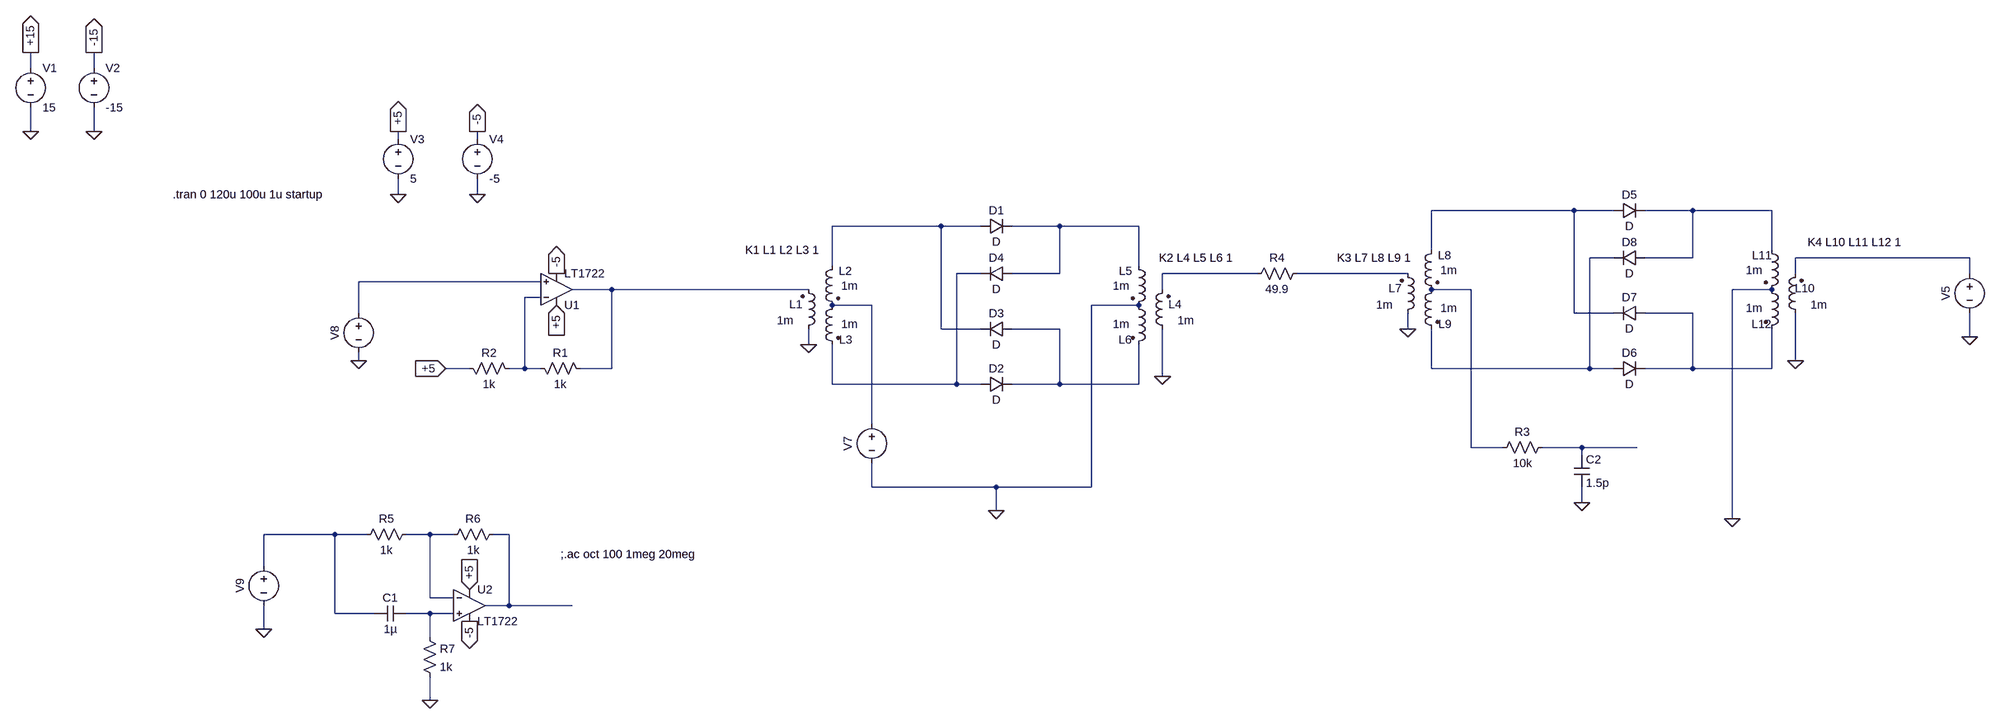
[diagram p0: schematic QPSK_Gilbert_Cell_Mixer.asc]
QPSK_Gilbert_Cell_Mixer.asc, the LTspice schematic file:
Version 4
SHEET 1 3956 1012
WIRE -624 -288 -624 -320
WIRE -496 -288 -496 -320
WIRE -624 -160 -624 -208
WIRE -496 -160 -496 -208
WIRE 416 -144 416 -160
WIRE 576 -144 576 -160
WIRE 416 -32 416 -64
WIRE 576 -32 576 -64
WIRE 2880 0 2592 0
WIRE 2960 0 2880 0
WIRE 3120 0 3024 0
WIRE 3280 0 3120 0
WIRE 1600 32 1312 32
WIRE 1680 32 1600 32
WIRE 1840 32 1744 32
WIRE 2000 32 1840 32
WIRE 2592 80 2592 0
WIRE 3280 80 3280 0
WIRE 2960 96 2912 96
WIRE 3120 96 3120 0
WIRE 3120 96 3024 96
WIRE 3680 96 3328 96
WIRE 1312 112 1312 32
WIRE 2000 112 2000 32
WIRE 1680 128 1632 128
WIRE 1840 128 1840 32
WIRE 1840 128 1744 128
WIRE 2240 128 2048 128
WIRE 2544 128 2320 128
WIRE 3328 128 3328 96
WIRE 3680 128 3680 96
WIRE 704 144 336 144
WIRE 848 160 768 160
WIRE 1264 160 848 160
WIRE 2048 160 2048 128
WIRE 2672 160 2592 160
WIRE 3280 160 3200 160
WIRE 704 176 672 176
WIRE 1392 192 1312 192
WIRE 2000 192 1904 192
WIRE 336 208 336 144
WIRE 2880 208 2880 0
WIRE 2960 208 2880 208
WIRE 3120 208 3024 208
WIRE 1600 240 1600 32
WIRE 1680 240 1600 240
WIRE 1840 240 1744 240
WIRE 2544 240 2544 208
WIRE 3680 256 3680 208
WIRE 1264 272 1264 240
WIRE 336 304 336 288
WIRE 3328 304 3328 208
WIRE 560 320 512 320
WIRE 672 320 672 176
WIRE 672 320 640 320
WIRE 704 320 672 320
WIRE 848 320 848 160
WIRE 848 320 784 320
WIRE 2592 320 2592 240
WIRE 2912 320 2912 96
WIRE 2912 320 2592 320
WIRE 2960 320 2912 320
WIRE 3120 320 3120 208
WIRE 3120 320 3024 320
WIRE 3280 320 3280 240
WIRE 3280 320 3120 320
WIRE 2048 336 2048 240
WIRE 1312 352 1312 272
WIRE 1632 352 1632 128
WIRE 1632 352 1312 352
WIRE 1680 352 1632 352
WIRE 1840 352 1840 240
WIRE 1840 352 1744 352
WIRE 2000 352 2000 272
WIRE 2000 352 1840 352
WIRE 1392 432 1392 192
WIRE 2672 480 2672 160
WIRE 2736 480 2672 480
WIRE 2896 480 2816 480
WIRE 3008 480 2896 480
WIRE 2896 496 2896 480
WIRE 1392 560 1392 512
WIRE 1712 560 1392 560
WIRE 1904 560 1904 192
WIRE 1904 560 1712 560
WIRE 2896 592 2896 560
WIRE 1712 608 1712 560
WIRE 3200 624 3200 160
WIRE 288 656 144 656
WIRE 352 656 288 656
WIRE 480 656 432 656
WIRE 528 656 480 656
WIRE 640 656 608 656
WIRE 144 720 144 656
WIRE 480 784 480 656
WIRE 528 784 480 784
WIRE 640 800 640 656
WIRE 640 800 592 800
WIRE 768 800 640 800
WIRE 288 816 288 656
WIRE 368 816 288 816
WIRE 480 816 432 816
WIRE 528 816 480 816
WIRE 144 848 144 800
WIRE 480 864 480 816
WIRE 480 992 480 944
FLAG -624 -320 +15
IOPIN -624 -320 Out
FLAG -496 -320 -15
IOPIN -496 -320 Out
FLAG -624 -160 0
FLAG -496 -160 0
FLAG 2048 336 0
FLAG 1712 608 0
FLAG 336 304 0
FLAG 416 -160 +5
IOPIN 416 -160 Out
FLAG 416 -32 0
FLAG 576 -32 0
FLAG 576 -160 -5
IOPIN 576 -160 Out
FLAG 1264 272 0
FLAG 512 320 +5
IOPIN 512 320 In
FLAG 736 128 -5
IOPIN 736 128 Out
FLAG 736 192 +5
IOPIN 736 192 In
FLAG 3328 304 0
FLAG 2544 240 0
FLAG 3680 256 0
FLAG 3200 624 0
FLAG 560 832 -5
IOPIN 560 832 Out
FLAG 560 768 +5
IOPIN 560 768 In
FLAG 480 992 0
FLAG 144 848 0
FLAG 2896 592 0
SYMBOL voltage -624 -304 R0
WINDOW 123 0 0 Left 0
WINDOW 39 0 0 Left 0
SYMATTR InstName V1
SYMATTR Value 15
SYMBOL voltage -496 -304 R0
WINDOW 123 0 0 Left 0
WINDOW 39 0 0 Left 0
SYMATTR InstName V2
SYMATTR Value -15
SYMBOL ind2 1248 256 M180
WINDOW 0 -23 66 Left 2
WINDOW 3 -48 33 Left 2
SYMATTR InstName L1
SYMATTR Value 1m
SYMATTR Type ind
SYMBOL ind2 1328 96 M0
WINDOW 0 -24 27 Left 2
WINDOW 3 -36 57 Left 2
SYMATTR InstName L2
SYMATTR Value 1m
SYMATTR Type ind
SYMBOL ind2 1328 176 M0
WINDOW 0 -25 86 Left 2
WINDOW 3 -36 54 Left 2
SYMATTR InstName L3
SYMATTR Value 1m
SYMATTR Type ind
SYMBOL diode 1680 48 R270
WINDOW 0 32 32 VTop 2
WINDOW 3 0 32 VBottom 2
SYMATTR InstName D1
SYMBOL diode 1680 368 R270
WINDOW 0 32 32 VTop 2
WINDOW 3 0 32 VBottom 2
SYMATTR InstName D2
SYMBOL ind2 2064 256 R180
WINDOW 0 -23 66 Left 2
WINDOW 3 -48 33 Left 2
SYMATTR InstName L4
SYMATTR Value 1m
SYMATTR Type ind
SYMBOL ind2 1984 96 R0
WINDOW 0 -24 27 Left 2
WINDOW 3 -36 57 Left 2
SYMATTR InstName L5
SYMATTR Value 1m
SYMATTR Type ind
SYMBOL ind2 1984 176 R0
WINDOW 0 -25 86 Left 2
WINDOW 3 -36 54 Left 2
SYMATTR InstName L6
SYMATTR Value 1m
SYMATTR Type ind
SYMBOL diode 1744 224 R90
WINDOW 0 0 32 VBottom 2
WINDOW 3 32 32 VTop 2
SYMATTR InstName D3
SYMBOL diode 1744 112 R90
WINDOW 0 0 32 VBottom 2
WINDOW 3 32 32 VTop 2
SYMATTR InstName D4
SYMBOL voltage 1392 416 R0
WINDOW 0 -32 56 VBottom 2
WINDOW 3 32 56 Invisible 2
WINDOW 123 0 0 Left 0
SYMATTR InstName V7
SYMATTR Value SINE(0 500m 10Meg 0 0 0)
SYMATTR SpiceLine Rser=0.0001
SYMBOL voltage 336 192 R0
WINDOW 0 -32 56 VBottom 2
WINDOW 3 32 56 Invisible 2
WINDOW 123 0 0 Left 0
SYMATTR InstName V8
SYMATTR Value PULSE(0 5 0 0.1u 0.1u 1u 2u)
SYMATTR SpiceLine Rser=0.0001
SYMBOL voltage 416 -160 R0
WINDOW 123 0 0 Left 0
WINDOW 39 0 0 Left 0
SYMATTR InstName V3
SYMATTR Value 5
SYMBOL voltage 576 -160 R0
WINDOW 123 0 0 Left 0
WINDOW 39 0 0 Left 0
SYMATTR InstName V4
SYMATTR Value -5
SYMBOL res 688 304 M90
WINDOW 0 0 56 VBottom 2
WINDOW 3 32 56 VTop 2
SYMATTR InstName R1
SYMATTR Value 1k
SYMBOL res 544 304 M90
WINDOW 0 0 56 VBottom 2
WINDOW 3 32 56 VTop 2
SYMATTR InstName R2
SYMATTR Value 1k
SYMBOL Opamps\\LT1722 736 224 M180
SYMATTR InstName U1
SYMBOL ind2 2528 224 M180
WINDOW 0 -23 66 Left 2
WINDOW 3 -48 33 Left 2
SYMATTR InstName L7
SYMATTR Value 1m
SYMATTR Type ind
SYMBOL ind2 2608 64 M0
WINDOW 0 -24 27 Left 2
WINDOW 3 -36 57 Left 2
SYMATTR InstName L8
SYMATTR Value 1m
SYMATTR Type ind
SYMBOL ind2 2608 144 M0
WINDOW 0 -25 86 Left 2
WINDOW 3 -36 54 Left 2
SYMATTR InstName L9
SYMATTR Value 1m
SYMATTR Type ind
SYMBOL diode 2960 16 R270
WINDOW 0 32 32 VTop 2
WINDOW 3 0 32 VBottom 2
SYMATTR InstName D5
SYMBOL diode 2960 336 R270
WINDOW 0 32 32 VTop 2
WINDOW 3 0 32 VBottom 2
SYMATTR InstName D6
SYMBOL ind2 3344 224 R180
WINDOW 0 -23 66 Left 2
WINDOW 3 -48 33 Left 2
SYMATTR InstName L10
SYMATTR Value 1m
SYMATTR Type ind
SYMBOL ind2 3264 64 R0
WINDOW 0 -24 27 Left 2
WINDOW 3 -36 57 Left 2
SYMATTR InstName L11
SYMATTR Value 1m
SYMATTR Type ind
SYMBOL ind2 3264 144 R0
WINDOW 0 -25 86 Left 2
WINDOW 3 -36 54 Left 2
SYMATTR InstName L12
SYMATTR Value 1m
SYMATTR Type ind
SYMBOL diode 3024 192 R90
WINDOW 0 0 32 VBottom 2
WINDOW 3 32 32 VTop 2
SYMATTR InstName D7
SYMBOL diode 3024 80 R90
WINDOW 0 0 32 VBottom 2
WINDOW 3 32 32 VTop 2
SYMATTR InstName D8
SYMBOL voltage 3680 112 R0
WINDOW 0 -32 56 VBottom 2
WINDOW 3 32 56 Invisible 2
WINDOW 123 0 0 Left 0
SYMATTR InstName V5
SYMATTR Value SINE(0 500m 10Meg 0 0 0)
SYMATTR SpiceLine Rser=0.0001
SYMBOL res 2336 112 R90
WINDOW 0 0 56 VBottom 2
WINDOW 3 32 56 VTop 2
SYMATTR InstName R4
SYMATTR Value 49.9
SYMATTR SpiceLine tol=1 pwr=0.1
SYMBOL res 448 640 R90
WINDOW 0 0 56 VBottom 2
WINDOW 3 32 56 VTop 2
SYMATTR InstName R5
SYMATTR Value 1k
SYMBOL res 624 640 R90
WINDOW 0 0 57 VBottom 2
WINDOW 3 32 56 VTop 2
SYMATTR InstName R6
SYMATTR Value 1k
SYMBOL Opamps\\LT1722 560 736 R0
SYMATTR InstName U2
SYMBOL cap 432 800 R90
WINDOW 0 0 32 VBottom 2
WINDOW 3 32 32 VTop 2
SYMATTR InstName C1
SYMATTR Value 1µ
SYMBOL res 464 848 R0
SYMATTR InstName R7
SYMATTR Value 1k
SYMBOL voltage 144 704 R0
WINDOW 0 -32 56 VBottom 2
WINDOW 3 32 56 Invisible 2
WINDOW 123 0 0 Left 0
SYMATTR InstName V9
SYMATTR Value SINE(0 500m 10Meg 0 0 0)
SYMATTR SpiceLine Rser=0.0001
SYMBOL res 2832 464 R90
WINDOW 0 0 56 VBottom 2
WINDOW 3 32 56 VTop 2
SYMATTR InstName R3
SYMATTR Value 10k
SYMBOL cap 2880 496 R0
SYMATTR InstName C2
SYMATTR Value 1.5p
TEXT -40 -32 Left 2 !.tran 0 120u 100u 1u startup
TEXT 1136 80 Left 2 !K1 L1 L2 L3 1
TEXT 2192 96 Right 2 !K2 L4 L5 L6 1
TEXT 3544 64 Right 2 !K4 L10 L11 L12 1
TEXT 2552 96 Right 2 !K3 L7 L8 L9 1
TEXT 744 696 Left 2 !;.ac oct 100 1meg 20meg

The netlist it stands for:
* QPSK_Gilbert_Cell_Mixer.asc
V1 +15 0 15
V2 -15 0 -15
L1 0 N011 1m
L2 N003 N014 1m
L3 N014 N007 1m
D1 N003 N004 D
D2 N007 N016 D
L4 0 N008 1m
L5 N004 0 1m
L6 0 N016 1m
D3 N016 N003 D
D4 N004 N007 D
V7 N014 0 SINE(0 500m 10Meg 0 0 0) Rser=0.0001
V8 N010 0 PULSE(0 5 0 0.1u 0.1u 1u 2u) Rser=0.0001
V3 +5 0 5
V4 -5 0 -5
R1 N013 N011 1k
R2 +5 N013 1k
XU1 N010 N013 +5 -5 N011 LT1722  ; pins In+ In- V+ V- OUT
L7 0 N009 1m
L8 N001 N012 1m
L9 N012 N005 1m
D5 N001 N002 D
D6 N005 N015 D
L10 0 N006 1m
L11 N002 0 1m
L12 0 N015 1m
D7 N015 N001 D
D8 N002 N005 D
V5 N006 0 SINE(0 500m 10Meg 0 0 0) Rser=0.0001
R4 N009 N008 49.9 tol=1 pwr=0.1
R5 N019 N018 1k
R6 N020 N019 1k
XU2 N021 N019 +5 -5 N020 LT1722  ; pins In+ In- V+ V- OUT
C1 N021 N018 1µ
R7 N021 0 1k
V9 N018 0 SINE(0 500m 10Meg 0 0 0) Rser=0.0001
R3 N017 N012 10k
C2 N017 0 1.5p
.model D D
.lib standard.dio
.tran 0 120u 100u 1u startup
K1 L1 L2 L3 1
K2 L4 L5 L6 1
K4 L10 L11 L12 1
K3 L7 L8 L9 1
;.ac oct 100 1meg 20meg
.backanno
.end